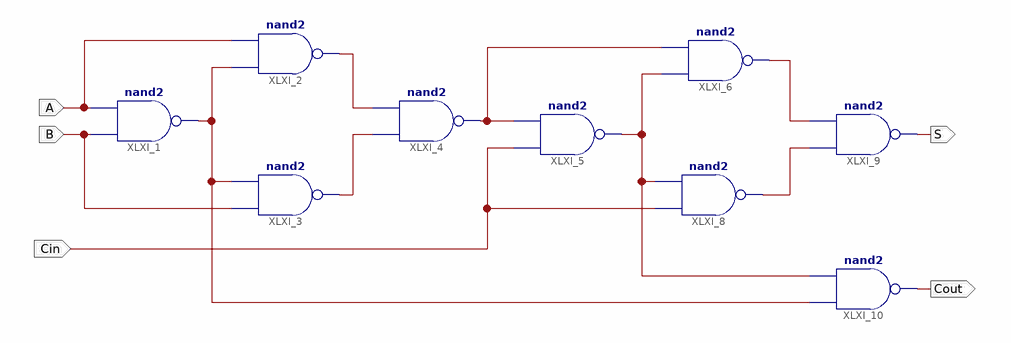
[diagram p0: schematic sheet 1]
// Xilinx ISE schematic lab4exp3.sch (spartan3e) as structural Verilog: 9 symbols, 5 ports
module lab4exp3 (
  input  A,
  input  B,
  input  Cin,
  output S,
  output Cout
);

  wire XLXN_3, XLXN_10, XLXN_11, XLXN_14, XLXN_15, XLXN_17, XLXN_18;

  nand XLXI_1 (XLXN_3, B, A);
  nand XLXI_2 (XLXN_10, XLXN_3, A);
  nand XLXI_3 (XLXN_11, B, XLXN_3);
  nand XLXI_4 (XLXN_14, XLXN_11, XLXN_10);
  nand XLXI_5 (XLXN_18, Cin, XLXN_14);
  nand XLXI_6 (XLXN_15, XLXN_18, XLXN_14);
  nand XLXI_8 (XLXN_17, Cin, XLXN_18);
  nand XLXI_9 (S, XLXN_17, XLXN_15);
  nand XLXI_10 (Cout, XLXN_3, XLXN_18);
endmodule
